# Altium schematic sheet STM32.SchDoc
size A; SheetNumber: 5; SheetTotal: 10
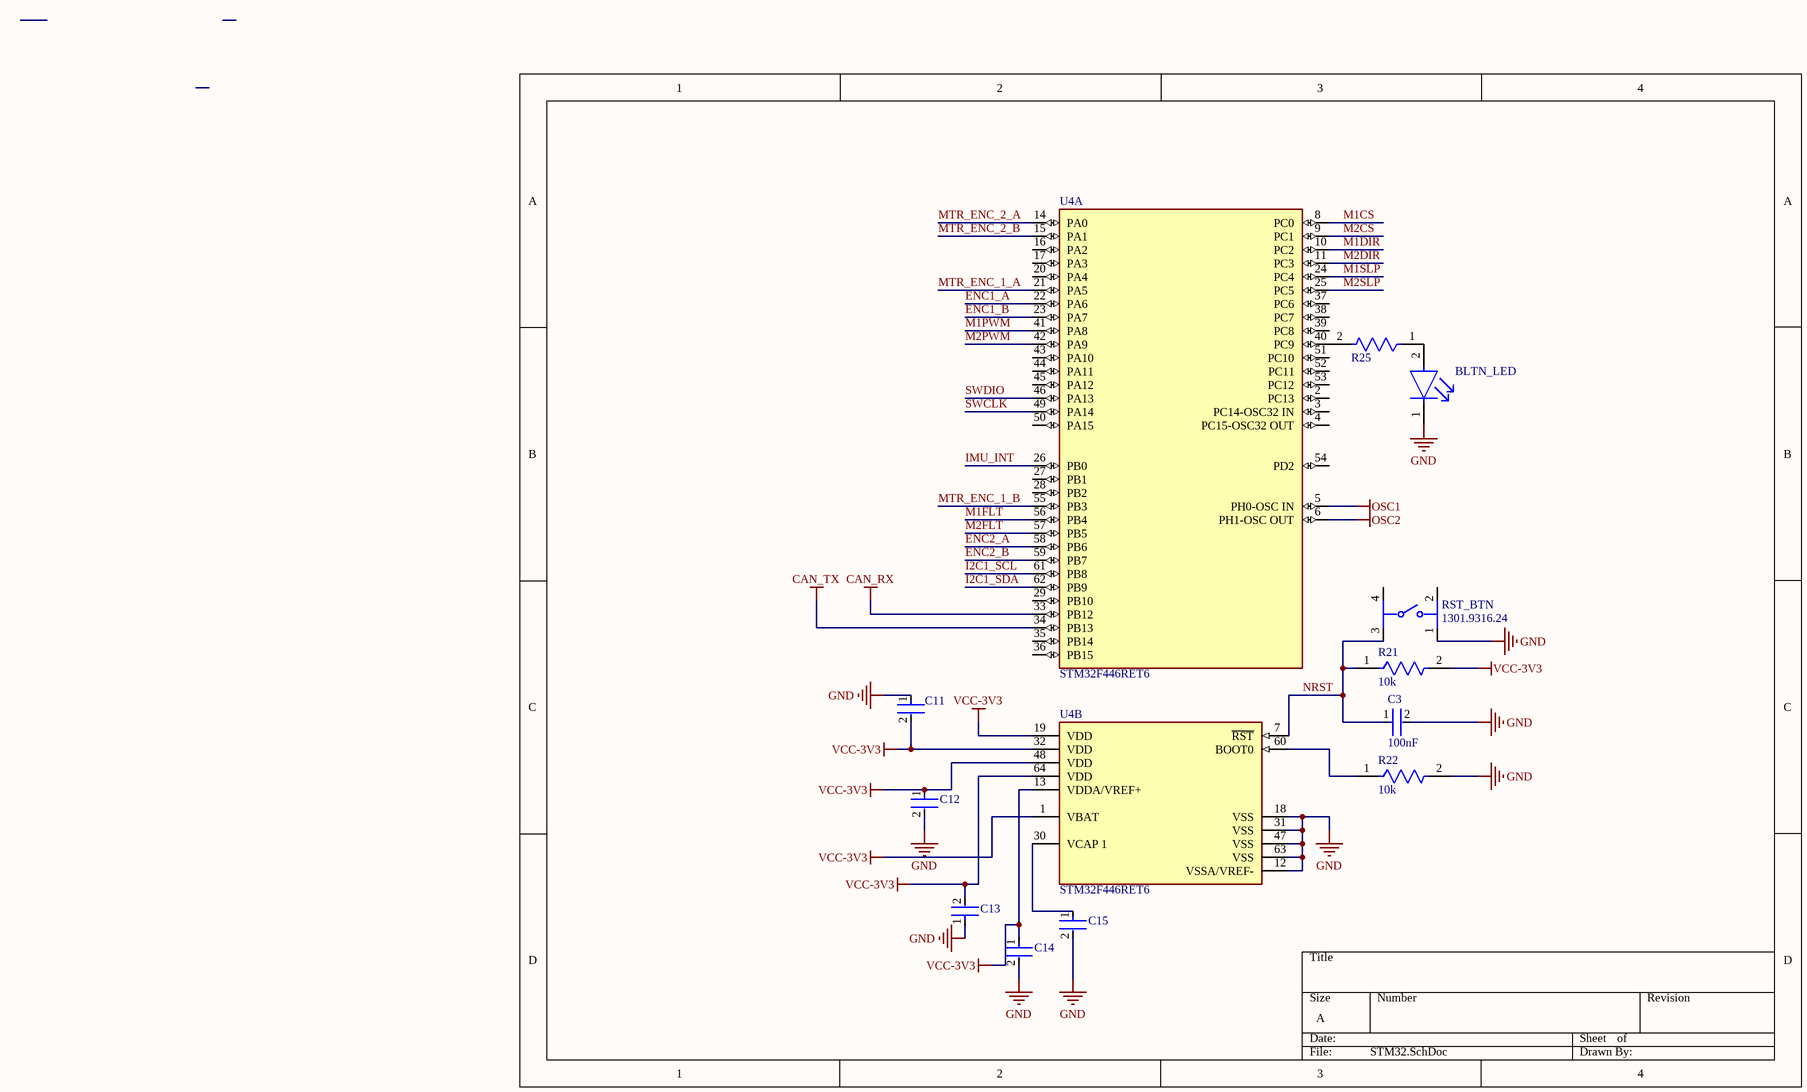
[diagram p0: STM32.SchDoc]

## Parts
BLTN_LED  APHCM2012CGCK-F01  [FP-APHCM2012CGCK-F01-MFG]  (value not drawn)
C3  100nF  [FP-0402B104K160CT-IPC_C]
C11  CC0603KRX7R9BB104  [FP-CC0603-DA-MFG]  (value not drawn)
C12  CC0603KRX7R9BB104  [FP-CC0603-DA-MFG]  (value not drawn)
C13  CC0603KRX7R9BB104  [FP-CC0603-DA-MFG]  (value not drawn)
C14  CC0603KRX7R9BB104  [FP-CC0603-DA-MFG]  (value not drawn)
C15  CL10A475KP8NNNC  [FP-CL10-IPC_C]  (value not drawn)
R21  10k  [FP-RC0603-0_55-IPC_C]
R22  10k  [FP-RC0603-0_55-IPC_C]
R25  AC0603FR-10470RL  [FP-AC0603-IPC_A]  (value not drawn)
RST_BTN  1301.9316.24  [FP-1301_9316_24-MFG]
U4  STM32F446RET6  [FP-LQFP64-5W-MFG]  (parts A,B of 2)

## Nets
CAN_RX: U4.33(PB12)
CAN_TX: U4.34(PB13)
GND: BLTN_LED.1(C) C3.2 C11.1 C12.2 C13.1 C14.2 C15.2 R22.2 RST_BTN.1 U4.12(VSSA/VREF-) U4.18(VSS) U4.31(VSS) U4.47(VSS) U4.63(VSS)
OSC1: U4.5(PH0-OSC_IN)
OSC2: U4.6(PH1-OSC_OUT)
VCC-3V3: C11.2 C12.1 C13.2 C14.1 R21.2 U4.1(VBAT) U4.13(VDDA/VREF+) U4.19(VDD) U4.32(VDD) U4.48(VDD) U4.64(VDD)
ENC1_A: U4.22(PA6)
ENC1_B: U4.23(PA7)
ENC2_A: U4.58(PB6)
ENC2_B: U4.59(PB7)
I2C1_SCL: U4.61(PB8)
I2C1_SDA: U4.62(PB9)
IMU_INT: U4.26(PB0)
M1CS: U4.8(PC0)
M1DIR: U4.10(PC2)
M1FLT: U4.56(PB4)
M1PWM: U4.41(PA8)
M1SLP: U4.24(PC4)
M2CS: U4.9(PC1)
M2DIR: U4.11(PC3)
M2FLT: U4.57(PB5)
M2PWM: U4.42(PA9)
M2SLP: U4.25(PC5)
MTR_ENC_1_A: U4.21(PA5)
MTR_ENC_1_B: U4.55(PB3)
MTR_ENC_2_A: U4.14(PA0)
MTR_ENC_2_B: U4.15(PA1)
NRST: C3.1 R21.1 RST_BTN.3 U4.7(~{RST})
SWCLK: U4.49(PA14)
SWDIO: U4.46(PA13)
NetBLTN_LED_2: BLTN_LED.2(A) R25.1
NetC15_1: C15.1 U4.30(VCAP_1)
NetR22_1: R22.1 U4.60(BOOT0)
NetR25_2: R25.2 U4.40(PC9)

Not connected (* = marked no-connect by the designer): RST_BTN 2 4; U4 2(PC13) 3(PC14-OSC32_IN) 4(PC15-OSC32_OUT) 16(PA2) 17(PA3) 20(PA4) 27(PB1) 28(PB2) 29(PB10) 35(PB14) 36(PB15) 37(PC6) 38(PC7) 39(PC8) 43(PA10) 44(PA11) 45(PA12) 50(PA15) 51(PC10) 52(PC11) 53(PC12) 54(PD2)

## Library data of the parts
BLTN_LED = CMP-44529-000062-1: LED GREEN CLEAR CHIP SMD; Dominant Wavelength: 570nm; Forward Current: 20mA; Number of LEDs: 1; Luminous Intensity: 40mcd; Forward Voltage: 2.1V; Viewing Angle: 110°; Illumination Color: Green; Lens Style: Clear; Mount: Surface Mount; Length: 2mm; Max Operating Temperature: 85°C; Series: APHCM; Width: 1.25mm; Lead Free: Lead Free; Wavelength: 570nm; Package Quantity: 1; Number of Pins: 2; Case Code (Metric): 2012; RoHS Compliant: Yes; Packaging: Tape and Reel; Lens Color: Clear; Case/Package: 0805; Case Code (Imperial): 0805; Test Current: 20mA; Color: Green; Min Operating Temperature: -40°C; Height: 0.4mm
C3 = CMP-45632-000002-1: CAP CER 0.1UF 16V X7R 0402; Tolerance: 10%; Case Code (Imperial): 0402; Length: 1mm; Radiation Hardening: No; Case Code (Metric): 1005; Max Operating Temperature: 125°C; Voltage Rating: 16V; Capacitance: 100nF; Voltage Rating (DC): 16V; Dielectric: X7R; RoHS Compliant: Yes; Packaging: Tape and Reel; Lead Free: Lead Free; Depth: 0.5mm; Case/Package: 0402; Min Operating Temperature: -55°C; Series: -
C11-C14 = CMP-2100-03601-2: CAP CER 0.1UF 50V X7R 0603; Manufacturer: YAGEO; Material: Ceramic; Capacitance: 100 nF; Temperature Coefficient: 15%; Tolerance: 0.1; Value: 100 nF; Description: CC0603 100 nF X7R 10.00% 50 V; Height: 0.9mm; Voltage: 50 V; ComponentLink2Description: Datasheet; Device Class L2: Capacitors; Temperature Range High: +125°C; Category: Cap; Footprint Url: http://www.yageo.com/exep/pages/download/literatures/UPY-C_GEN_24.pdf; ComponentLink2URL: http://www.yageo.com/documents/recent/UPY-GPHC_X7R_6.3V-to-50V_18.pdf; Package: CC0603-DA; Temperature: -55°C to +125°C; Voltage Rating: 50 V; Temperature Characteristic: X7R; Device Class L1: Passive Components; Temperature Range Low: -55°C; Manufacturer Part Number: CC0603KRX7R9BB104; RoHS: TRUE; Automotive: No; Device Class L3: Ceramic Capacitors; Octopart: https://octopart.com/cc0603krx7r9bb104-yageo-42244635; Mouser Description: Multilayer Ceramic Capacitor, CC Series, 0.1 - F, - 10%, X7R, 50 V, 0603 [1608 Metric]; Lead Free: Yes; Digikey Description: CAP CER 0.1UF 50V X7R 0603
C15 = CMP-13271-003017-1: Cap Ceramic 4.7uF 10V X5R ±10% Pad SMD 0603 +85°C T/R; Capacitance: 4.7uF; Case/Package: 0603; Packaging: Tape and Reel; Width: 0.031inch; Contact Plating: Tin; Thickness: 0.035inch; Package Quantity: 1; Voltage Rating: 10V; Case Code (Metric): 1608; Case Code (Imperial): 0603; Depth: 0.8mm; Height: 0.8mm; Tolerance: 10%; Max Operating Temperature: 85°C; Length: 1.6mm; Dielectric: X5R; Mount: Surface Mount; Radiation Hardening: No; Min Operating Temperature: -55°C
R21 R22 = CMP-2100-03664-2: RES 10K OHM 1% 1/10W 0603; Voltage Rating: 75V; Voltage Rating (DC): 50V; Resistance: 10kR; Power Rating: 100mW; Temperature Coefficient: 100ppm/°C; Depth: 0.8mm; Termination: SMD/SMT; Resistor Type: Thick Film; Series: RC; Construction: Rectangular; Features: Moisture Resistant; Packaging: Tape and Reel; Min Operating Temperature: -55°C; Number of Terminations: 2; Lead Pitch: 0.3mm; RoHS Compliant: Yes; Case/Package: 0603; Resistance Tolerance: 1%; Military Standard: Not; Weight: 7.1E-05oz; Number of Pins: 2; Tolerance: 1%; Length: 1.6mm; Case Code (Imperial): 0603; Lead Free: Lead Free; Width: 0.8mm; Max Power Dissipation: 100mW; Height: 0.45mm; Max Operating Temperature: 155°C; Case Code (Metric): 1608; Size Code: 0603
R25 = CMP-03412-002877-2: RES 470Ω 1.00% 0.1W 0603; Tolerance: 1%; Resistance: 470R; Case/Package: 0603; RoHS Compliant: Yes
RST_BTN = CMP-26321-000004-1: LSH 6X6 SHORT TRAVEL SWITCH 7.00; Voltage Rating (DC): 12V; Mechanical Life: 100000Cycles; Throw Configuration: SPST; Operating Force: 1.6N; Max Current Rating: 50mA; Min Operating Temperature: -20°C; Mount: Surface Mount; Max Voltage Rating (DC): 12V; Length: 6mm; Packaging: Tape and Reel; Case/Package: SMD/SMT; Radiation Hardening: No; Orientation: Straight; Termination: Gull Wing; RoHS Compliant: Yes; Max Operating Temperature: 70°C; Depth: 10mm
U4 = CMP-12105-000007-1: IC MCU 32BIT 512KB FLASH 64LQFP; Manufacturer: ST; Number Of Spi Channels: 4; Ram Size: 128KBytes; Standoff Height: 0.05mm; Number Of Uart Channels: 6; Number Of Pwm Channels: 32; Max Junction Temp: +105°C; Number Of I/Os: 50; Number Of Usb Channels: 2; Frequency: 180MHz; Number Of A/D Converters: 3; Max Supply Voltage: 3.6V; Number Of Adc Channels: 16; Interface: I2C,SPI,UART,USART,CAN,USB,LIN,IrDA,I2S,Other; Memory Size: 512KBytes; Number Of Timers/Counters: 14; Min Supply Voltage: 1.7V; Core Architecture: ARM Cortex-M4; Data Bus Width: 32bits; Number Of Cores: 1; Ambient Temperature Range Low: -40°C; ComponentLink2URL: https://www.st.com/en/microcontrollers-microprocessors/stm32f446re.html; Category: IC; Height: 1.6mm; Ipc Land Pattern Name: QFP50P1200X1200X160-64; Manufacturer Part Number: STM32F446RET6; Octopart: https://octopart.com/stm32f446ret6-stmicroelectronics-52642920; Temperature Range High: +105°C; Lead Free: Yes; Mouser Description: ARM Microcontrollers - MCU High-performance and DSP with FP, ARM Cortex-M4 MCU with 512 Kbytes Flash, 180 MHz CPU, Art Accelerator, SDRAM; Digikey Description: IC MCU 32BIT 512KB FLASH 64LQFP; Ambient Temperature Range High: +85°C; Number Of I2C Channels: 4; Memory Type: FLASH; RoHS: TRUE; Automotive: No; Device Class L1: Integrated Circuits (ICs); Temperature: -40°C to +105°C; Device Class L2: Embedded Processors and Controllers; Device Class L3: Microcontrollers; Temperature Range Low: -40°C; Package: LQFP64-5W; ComponentLink2Description: Datasheet